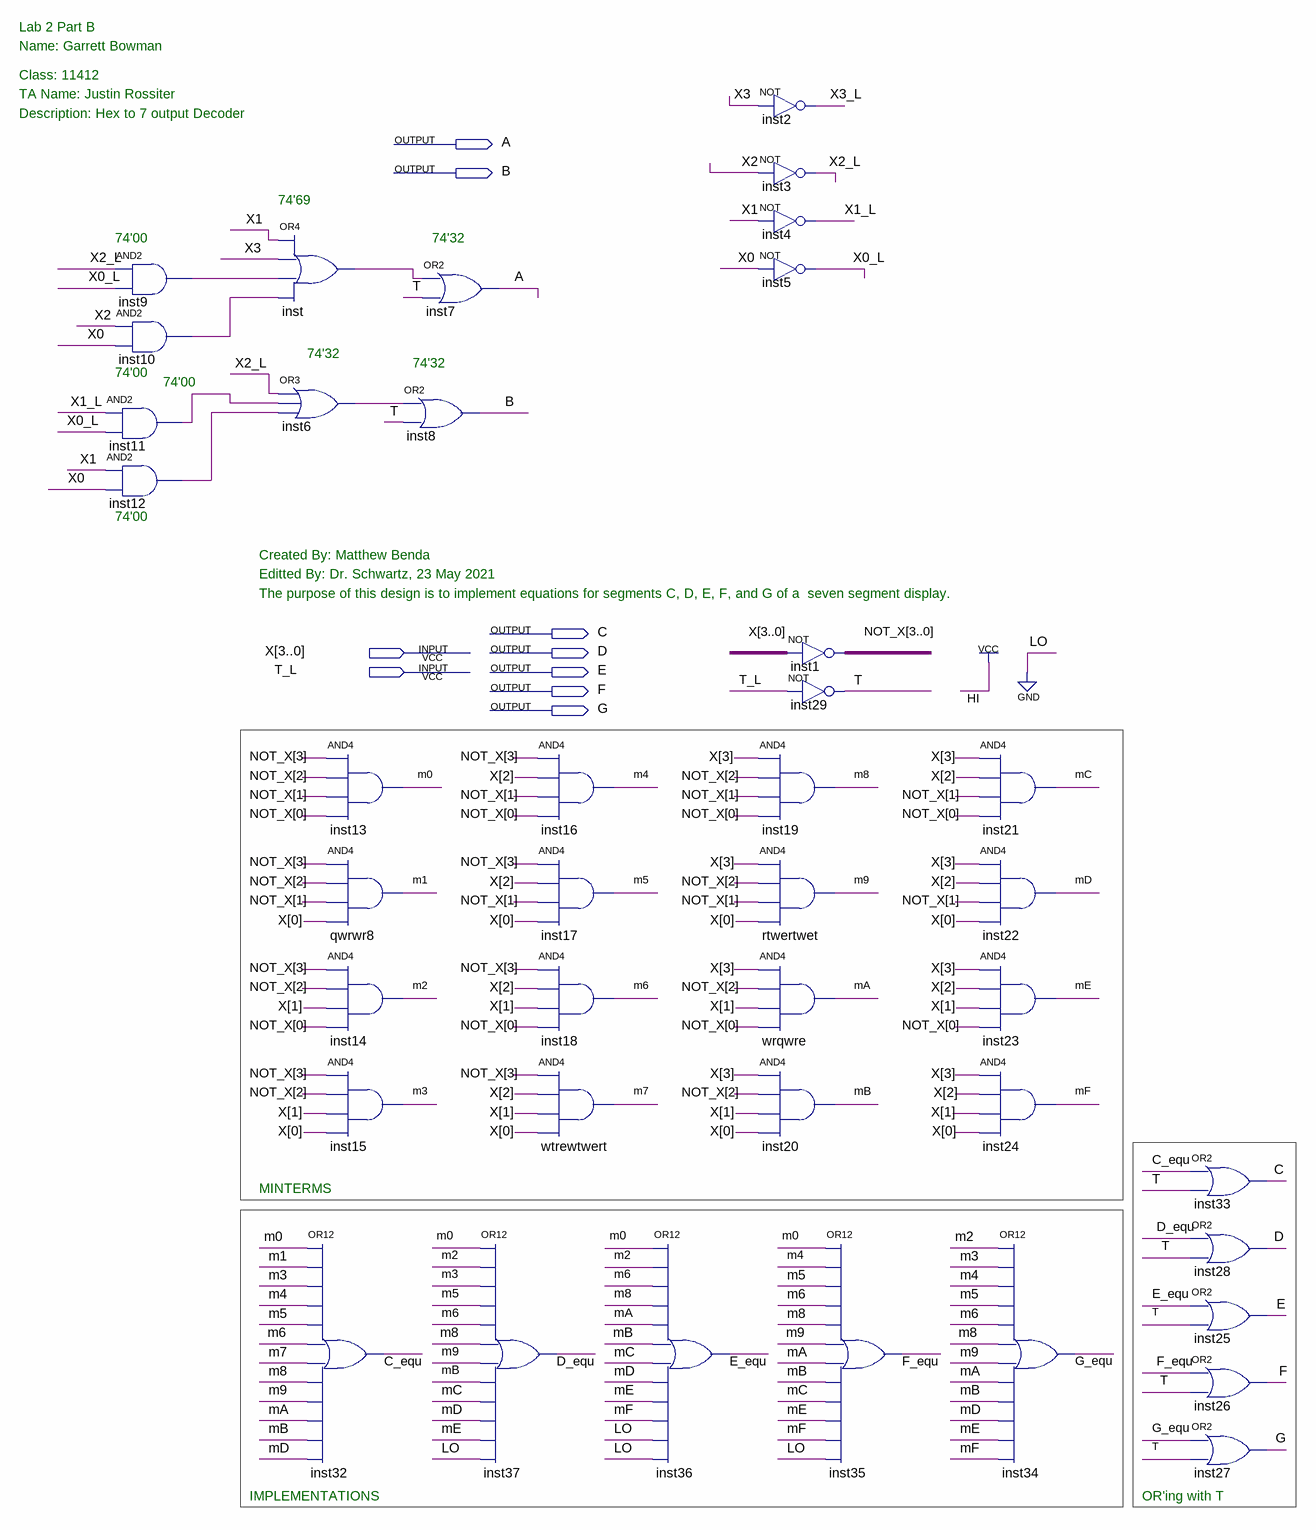
[diagram p0: schematic sheet]
// Quartus schematic Lab3_7segDecoder.bdf as structural Verilog: 40 symbols, 9 pins
module Lab3_7segDecoder (
  input  [3:0] X,
  input  T_L,
  output A,
  output B,
  output C,
  output D,
  output E,
  output F,
  output G
);

  wire C_equ, D_equ, E_equ, F_equ, G_equ, inst6_out, inst9_out, inst10_out, inst11_out, inst12_out, inst_out,
       m0, m1, m2, m3, m4, m5, m6, m7, m8, m9, mA, mB, mC, mD, mE, mF, T, X0_L, X1_L, X2_L, X3_L;
  wire [3:0] NOT_X;

  and inst9 (inst9_out, X2_L, X0_L);
  and inst10 (inst10_out, X[2], X[0]);
  and inst11 (inst11_out, X1_L, X0_L);
  and inst12 (inst12_out, X[1], X[0]);
  or inst (inst_out, X[1], X[3], inst9_out, inst10_out);
  or inst6 (inst6_out, X2_L, inst11_out, inst12_out);
  and inst13 (m0, NOT_X[3], NOT_X[2], NOT_X[1], NOT_X[0]);
  and qwrwr8 (m1, NOT_X[3], NOT_X[2], NOT_X[1], X[0]);
  and inst14 (m2, NOT_X[3], NOT_X[2], X[1], NOT_X[0]);
  and inst15 (m3, NOT_X[3], NOT_X[2], X[1], X[0]);
  or inst32 (C_equ, m0, m1, m3, m4, m5, m6, m7, m8, m9, mA, mB, mD);
  or inst7 (A, inst_out, T);
  or inst8 (B, inst6_out, T);
  or inst37 (D_equ, m0, m2, m3, m5, m6, m8, m9, mB, mC, mD, mE, 1'b0);
  and inst16 (m4, NOT_X[3], X[2], NOT_X[1], NOT_X[0]);
  and inst17 (m5, NOT_X[3], X[2], NOT_X[1], X[0]);
  and inst18 (m6, NOT_X[3], X[2], X[1], NOT_X[0]);
  and wtrewtwert (m7, NOT_X[3], X[2], X[1], X[0]);
  or inst36 (E_equ, m0, m2, m6, m8, mA, mB, mC, mD, mE, mF, 1'b0, 1'b0);
  not inst2 (X3_L, X[3]);
  not inst3 (X2_L, X[2]);
  not inst4 (X1_L, X[1]);
  not inst5 (X0_L, X[0]);
  assign NOT_X = ~X;  // NOT inst1, 4 bits wide
  not inst29 (T, T_L);
  and inst19 (m8, X[3], NOT_X[2], NOT_X[1], NOT_X[0]);
  and rtwertwet (m9, X[3], NOT_X[2], NOT_X[1], X[0]);
  and wrqwre (mA, X[3], NOT_X[2], X[1], NOT_X[0]);
  and inst20 (mB, X[3], NOT_X[2], X[1], X[0]);
  or inst35 (F_equ, m0, m4, m5, m6, m8, m9, mA, mB, mC, mE, mF, 1'b0);
  and inst21 (mC, X[3], X[2], NOT_X[1], NOT_X[0]);
  and inst22 (mD, X[3], X[2], NOT_X[1], X[0]);
  and inst23 (mE, X[3], X[2], X[1], NOT_X[0]);
  and inst24 (mF, X[3], X[2], X[1], X[0]);
  or inst34 (G_equ, m2, m3, m4, m5, m6, m8, m9, mA, mB, mD, mE, mF);
  or inst33 (C, C_equ, T);
  or inst28 (D, D_equ, T);
  or inst25 (E, E_equ, T);
  or inst26 (F, F_equ, T);
  or inst27 (G, G_equ, T);

  // Notes on the sheet:
  //   Lab 2 Part B
  //   Name: Garrett Bowman
  //   Class: 11412
  //   TA Name: Justin Rossiter
  //   Description: Hex to 7 output Decoder
  //   74'69
  //   74'00
  //   74'32
  //   74'32
  //   74'32
  //   74'00
  //   74'00
  //   74'00
  //   Created By: Matthew Benda
  //   Editted By: Dr. Schwartz, 23 May 2021
  //   The purpose of this design is to implement equations for segments C, D, E, F, and G of a  seven segment display.            
  //   MINTERMS
  //   IMPLEMENTATIONS
  //   OR'ing with T
endmodule
